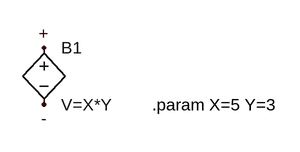
[diagram p0: schematic param_test_hierarchical_block.asc]
param_test_hierarchical_block.asc, the LTspice schematic file:
Version 4
SHEET 1 880 680
FLAG 128 128 +
FLAG 128 208 -
SYMBOL bv 128 112 R0
SYMATTR InstName B1
SYMATTR Value V=X*Y
TEXT 280 208 Left 2 !.param X=5 Y=3

The netlist it stands for:
* param_test_hierarchical_block.asc
B1 + - V=X*Y
.param X=5 Y=3
.backanno
.end